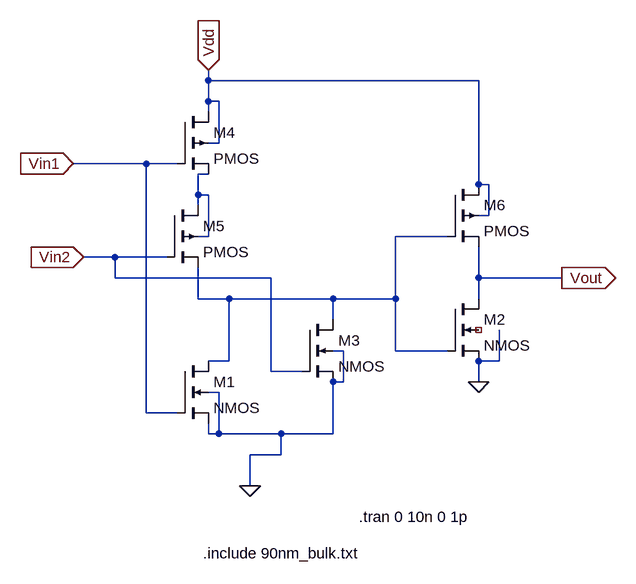
[diagram p0: schematic or.asc]
or.asc, the LTspice schematic file:
Version 4
SHEET 1 968 680
WIRE -160 -464 -160 -480
WIRE 256 -464 -160 -464
WIRE -160 -432 -160 -464
WIRE -144 -432 -160 -432
WIRE -160 -416 -160 -432
WIRE -144 -368 -144 -432
WIRE -144 -368 -160 -368
WIRE -256 -336 -368 -336
WIRE -208 -336 -256 -336
WIRE -160 -320 -176 -320
WIRE 256 -304 256 -464
WIRE 272 -304 256 -304
WIRE -176 -288 -176 -320
WIRE -160 -288 -176 -288
WIRE -176 -272 -176 -288
WIRE 272 -256 272 -304
WIRE 272 -256 256 -256
WIRE -160 -224 -160 -288
WIRE -160 -224 -176 -224
WIRE 208 -224 128 -224
WIRE -304 -192 -352 -192
WIRE -224 -192 -304 -192
WIRE -304 -160 -304 -192
WIRE -64 -160 -304 -160
WIRE 256 -160 256 -208
WIRE 384 -160 256 -160
WIRE -176 -128 -176 -176
WIRE -128 -128 -176 -128
WIRE 32 -128 -128 -128
WIRE 128 -128 128 -224
WIRE 128 -128 32 -128
WIRE 256 -128 256 -160
WIRE 32 -96 32 -128
WIRE 48 -48 32 -48
WIRE 128 -48 128 -128
WIRE 208 -48 128 -48
WIRE -128 -32 -128 -128
WIRE -128 -32 -160 -32
WIRE 288 -32 288 -80
WIRE 288 -32 256 -32
WIRE -64 -16 -64 -160
WIRE -16 -16 -64 -16
WIRE 48 0 48 -48
WIRE 48 0 32 0
WIRE 256 0 256 -32
WIRE -144 16 -160 16
WIRE -256 48 -256 -336
WIRE -208 48 -256 48
WIRE -160 80 -160 64
WIRE -144 80 -144 16
WIRE -144 80 -160 80
WIRE -48 80 -144 80
WIRE 32 80 32 0
WIRE 32 80 -48 80
WIRE -48 112 -48 80
WIRE -48 112 -96 112
WIRE -96 160 -96 112
FLAG -368 -336 Vin1
IOPIN -368 -336 In
FLAG -352 -192 Vin2
IOPIN -352 -192 In
FLAG -96 160 0
FLAG -160 -480 Vdd
IOPIN -160 -480 In
FLAG 256 0 0
FLAG 384 -160 Vout
IOPIN 384 -160 Out
SYMBOL nmos4 -208 -32 R0
SYMATTR InstName M1
SYMATTR Value2 l=90n w=200n
SYMBOL nmos4 -16 -96 R0
SYMATTR InstName M3
SYMATTR Value2 l=90n w=200n
SYMBOL pmos4 -208 -416 R0
SYMATTR InstName M4
SYMATTR Value2 l=90n w=400n
SYMBOL pmos4 -224 -272 R0
SYMATTR InstName M5
SYMATTR Value2 l=90n w=400n
SYMBOL nmos4 208 -128 R0
SYMATTR InstName M2
SYMATTR Value2 l=90n w=200n
SYMBOL pmos4 208 -304 R0
SYMATTR InstName M6
SYMATTR Value2 l=90n w=400n
TEXT -168 264 Left 2 !.include 90nm_bulk.txt
TEXT 72 208 Left 2 !.tran 0 10n 0 1p

The netlist it stands for:
* or.asc
M1 N002 Vin1 0 0 NMOS l=90n w=200n
M3 N002 Vin2 0 0 NMOS l=90n w=200n
M4 Vdd Vin1 N001 Vdd PMOS l=90n w=400n
M5 N001 Vin2 N002 N001 PMOS l=90n w=400n
M2 Vout N002 0 NC_01 NMOS l=90n w=200n
M6 Vdd N002 Vout Vdd PMOS l=90n w=400n
.model NMOS NMOS
.model PMOS PMOS
.lib standard.mos
.include 90nm_bulk.txt
.tran 0 10n 0 1p
.backanno
.end